# Altium schematic sheet Boost.SchDoc
size A
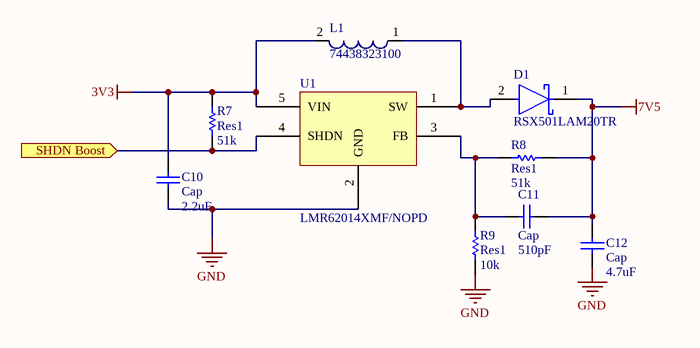
[diagram p0: Boost.SchDoc]

## Parts
C10  Cap  value 2.2uF  [1608[0603]]
C11  Cap  value 510pF  [6-0805_M]
C12  Cap  value 4.7uF  [6-0805_M]
D1  RSX501LAM20TR  [FP-PMDTM-MFG]
L1  74438323100  [SMD 2510]
R7  Res1  value 51k  [1608[0603]]
R8  Res1  value 51k  [1608[0603]]
R9  Res1  value 10k  [0402-A]
U1  LMR62014XMF/NOPD  [SOT95P280X145-5N]

## Ports
SHDN Boost (in)

## Nets
3V3: C10.2 L1.2 R7.1 U1.5(VIN)
7V5: C11.1 C12.2 D1.1(C) R8.2
GND: C10.1 C12.1 R9.2 U1.2(GND)
SHDN Boost: R7.2 U1.4(SHDN) ; port SHDN Boost
NetC11_2: C11.2 R8.1 R9.1 U1.3(FB)
NetD1_2: D1.2(A) L1.1 U1.1(SW)

## Library data of the parts
C10-C12 = Cap: Capacitor; Published: 8-Jun-2000; LatestRevisionDate: 17-Jul-2002; LatestRevisionNote: Re-released for DXP Platform.; PackageReference: RAD-0.3; Publisher: Altium Limited; PackageDescription: Radial Cap, Thru-Hole; 2 Leads; 0.3 in Pin Spacing
D1 = CMP-08971-000008-1: DIODE SCHOTTKY 20V 5A PMDTM; Manufacturer: Rohm; Max Surge Forward Current: 100A; Max Junction Temp: +125°C; Description: Diode Schottky 20V 5A Surface Mount PMDTM; Max Repetitive Reverse Voltage: 25V; Peak Reverse Current: 500uA; Automotive: No; Digikey Description: DIODE SCHOTTKY 20V 5A PMDTM; Temperature Range High: +125°C; Height: 1.05mm; Octopart: https://octopart.com/rsx501lam20tr-rohm-82270774; Lead Free: Yes; ComponentLink2URL: https://fscdn.rohm.com/en/products/databook/datasheet/discrete/diode/schottky_barrier/rsx501lam20tr-e.pdf; Device Class L2: Diodes; ComponentLink2Description: Datasheet; Device Class L1: Discrete Semiconductors; RoHS: TRUE; Reverse Voltage: 20V; Package: PMDTM; Category: Diode; Temperature: to +125°C; Device Class L3: Schottky Diodes; Manufacturer Part Number: RSX501LAM20TR; Forward Current: 5A
L1 = CMP-1411-00017-1: Power Multilayer Inductor WE-MAPI, L=10.0µH; Manufacturer: Wuerth Elektronik; Inductance: 10.0ÂµH; PartNumber: 74438323100; ComponentLink1URL: http://www.we-online.com; ComponentLink2Description: Datasheet; ComponentLink1Description: Manufacturer URL; PackageReference: SMD 2510; ComponentLink2URL: http://katalog.we-online.de/kataloge/eisos/media/pdf/74438323100.pdf
R7-R9 = Res1: Resistor; Published: 8-Jun-2000; LatestRevisionDate: 17-Jul-2002; LatestRevisionNote: Re-released for DXP Platform.; PackageReference: AXIAL-0.3; Publisher: Altium Limited; PackageDescription: Axial Device, Thru-Hole; 2 Leads; 0.3 in Pin Spacing